# EAGLE design power mux-v7 (EAGLE 6.5.0)
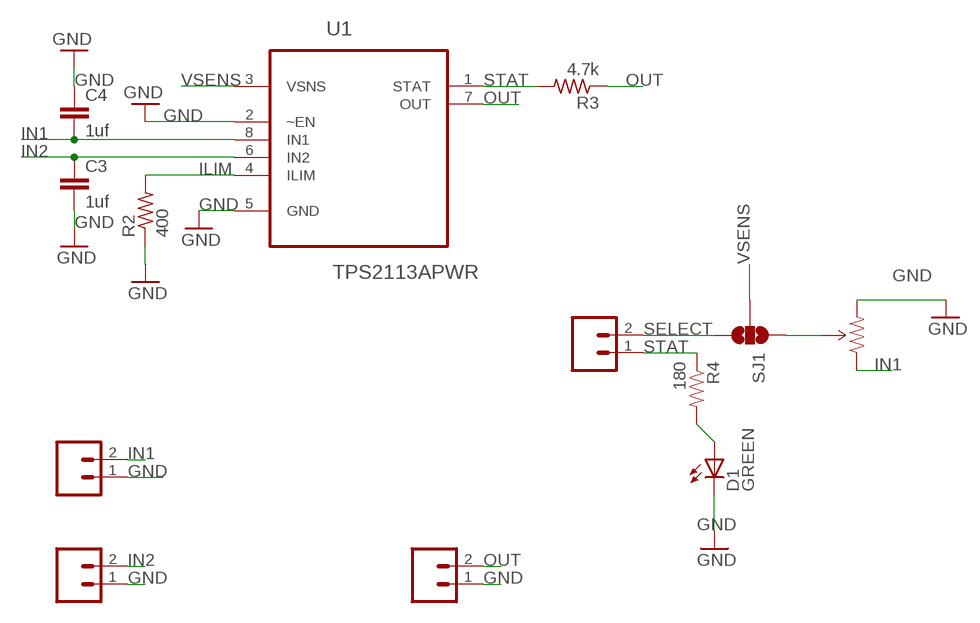
[diagram p0: schematic, sheet 1]

## Parts
C3  1uf  CAP0402-CAP  [0402-CAP]
C4  1uf  CAP0402-CAP  [0402-CAP]
D1  GREEN  LED-GREEN0603  [LED-0603]
JP3  M021X02_NO_SILK  [1X02_NO_SILK]
JP4  M021X02_NO_SILK  [1X02_NO_SILK]
JP5  M021X02_NO_SILK  [1X02_NO_SILK]
JP6  M021X02_NO_SILK  [1X02_NO_SILK]
R1  TRIMPOT-PTH-KNOB  [3386U]
R2  400  R-US_R0402  [R0402]
R3  4.7k  R-US_R0402  [R0402]
R4  180  RESISTOR0402-RES  [0402-RES]
SJ1  SOLDERJUMPER_2WAYPASTE1&2  [SJ_3_PASTE1&2]
U1  TPS2113APWR  [SOP65P640X120-8N]

## Nets
GND: C3.2 C4.1 D1.C JP3.1 JP4.1 JP6.1 R1.3(CW) R2.1 U1.2(~EN) U1.5(GND)
ILIM: R2.2 U1.4(ILIM)
IN1: C4.2 JP3.2 R1.1(CCW) U1.8(IN1)
IN2: C3.1 JP4.2 U1.6(IN2)
N$1: D1.A R4.2
N$2: R1.2(WIPER) SJ1.1
OUT: JP6.2 R3.1 U1.7(OUT)
SELECT: JP5.2 SJ1.3
STAT: JP5.1 R3.2 R4.1 U1.1(STAT)
VSENS: SJ1.2 U1.3(VSNS)

## Library data of the parts
C3 C4 = SparkFun-Capacitors:CAP: Capacitor Standard 0603 ceramic capacitor, and 0.1" leaded capacitor.
D1 = SparkFun-LED:LED-GREEN: Various green LEDs 0603- DIO-00821 LARGE- DIO-00862 LILYPAD- DIO-09910; PROD_ID: DIO-00821
JP3-JP6 = SparkFun-Connectors:M02: Standard 2-pin 0.1" header. Use with - straight break away headers ( PRT-00116) - right angle break away headers (PRT-00553) - swiss pins (PRT-00743) - machine pins (PRT-00117) - female headers (PRT-00115) Molex polarized connector foot print use with: PRT-08233 with associated crimp pins and housings. 2.54_SCREWTERM for use with PRT-10571. 3.5mm Screw Terminal footprints for PRT-08084 5mm Screw Terminal footprints for use with PRT-08433
R1 = SparkFun-Electromechanical:TRIMPOT: Various small potentiometers for "set-and-forget" applications
R2 R3 = resistor:R-US_: RESISTOR, American symbol
R4 = SparkFun-Passives:RESISTOR: Resistor Basic schematic elements and footprints for 0603, 1206, and PTH resistors.
SJ1 = SparkFun-Passives:SOLDERJUMPER_2WAY: Solder Jumper 2 way solder jumper
U1 = Texas Instruments_By_element14_Batch_1:TPS2113APWR: AUTOSWITCHING POWER MUX; MPN: TPS2113APWR; OC_FARNELL: 1757288; OC_NEWARK: 01J0961; PACKAGE: TSSOP-8; SUPPLIER: TEXAS INSTRUMENTS

## Board
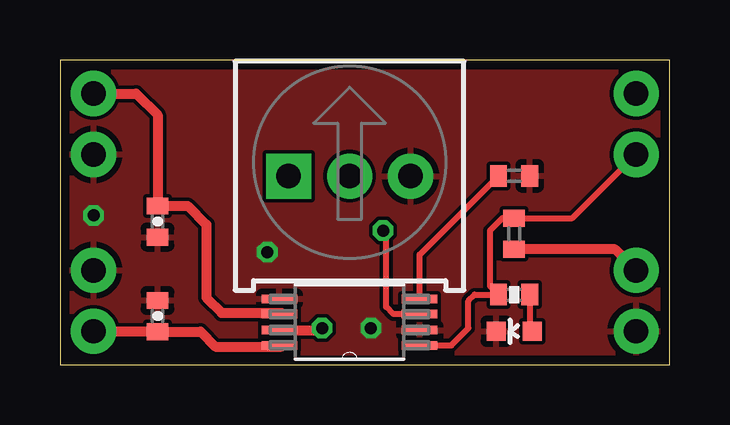
[diagram p1: board, top side]
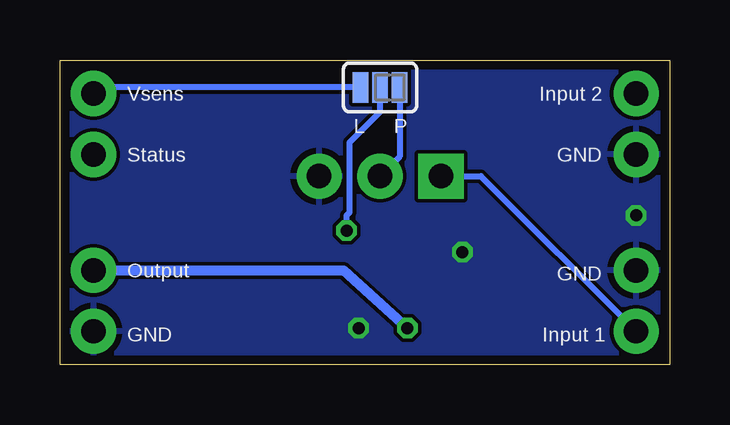
[diagram p2: board, bottom side, seen from below]

Size 25.4 x 12.7 mm. Coordinates in mm from the lower left corner, seen from the top.
Outline: 0,0 25.4,0 25.4,12.7 0,12.7 0,0
Copper layers (1*16): Top 0.0356mm / dielectric 1.5011mm / Bottom 0.0356mm
Design rules "LaenPCBOrder": minimum track width 6mil, minimum drill 13mil, track to track 6mil, track to pad 6mil, pad to pad 6mil, via to via 6mil, smd to smd 6mil, copper to edge 15mil, drill to drill 6mil, minimum pad ring 7mil, minimum via ring 7mil, stop-mask expansion 3mil, vias tented up to drill 0mil, thermal gap 10mil

### Footprints (pad centres in the part's own frame; a part is rotated, then mirrored left to right if it is on the bottom)
0402-CAP = smd 0.7 x 0.9: 1 -0.65,0; 2 0.65,0
LED-0603 = smd 0.8 x 0.8: A 0,-0.75; C 0,0.75
1X02_NO_SILK = drill 1.016 pad 1.88: 1 0,0; 2 2.54,0
3386U = drill 1.016 pad 1.88 square: 1 -2.54,-0.015 | drill 1.016 pad 1.88: 2 0,-0.015; 3 2.54,-0.015
R0402 = smd 0.7 x 0.9: 1 -0.65,0; 2 0.65,0
0402-RES = smd 0.7 x 0.9: 1 -0.65,0; 2 0.65,0
SJ_3_PASTE1&2 = smd 0.635 x 1.27: 1 -0.813,0; 2 0,0; 3 0.813,0
SOP65P640X120-8N = smd 1.473 x 0.356: 1 -2.921,0.965; 2 -2.921,0.33; 3 -2.921,-0.33; 4 -2.921,-0.965; 5 2.921,-0.965; 6 2.921,-0.33; 7 2.921,0.33; 8 2.921,0.965

### Placement (x,y rotation side)
C3  4.06,5.97 270 top
C4  4.06,2.03 270 top
D1  18.92,1.4 90 top
JP3  1.4,3.94 270 top
JP4  1.4,8.76 90 top
JP5  24,8.76 90 top
JP6  24,1.4 90 top
R1  12.06,7.87 0 top
R2  18.92,7.87 180 top
R3  18.92,5.46 90 top
R4  18.92,2.92 0 top
SJ1  12.06,11.56 180 bottom
U1  12.06,1.78 180 top

### Tracks (layer width: path | path; a pad name or v marks a point on that pad's centre or on a via)
GND  (via drill 0.5)
  other vias: 8.64,4.7 1.4,6.22 12.95,1.52
  pour Bottom: 0,12.7 25.4,12.7 25.4,0 0,0
  pour Top: 0,12.7 25.4,12.7 25.4,0 0,0
ILIM
  Top 0.254: U1.4 14.99,4.59 R2.2
IN1
  Top 0.406: JP3.2 4.05,1.4 C4.2 5.86,1.38 6.48,0.76 9.22,0.76 U1.8
  Bottom 0.254: R1.1 7.86,7.86 JP3.2
IN2
  Top 0.406: JP4.2 3.17,11.3 4.06,10.41 C3.1 5.32,6.62 6.1,5.84 6.1,2.79 6.73,2.16 9.22,2.16 U1.6
N$1
  Top 0.254: R4.2 19.57,1.5 D1.A
N$2
  Bottom 0.254: SJ1.1 11.25,8.67 R1.2
OUT  (via drill 0.5)
  Top 0.406: U1.7 10.85,1.45 v10.92,1.52 | JP6.2 23.13,4.81 R3.1
  Bottom 0.406: JP6.2 13.59,3.94 v10.92,1.52
SELECT
  Bottom 0.254: SJ1.3 23.75,11.56 JP5.2
STAT
  Top 0.254: JP5.1 21.35,6.11 R3.2 18.43,6.11 17.91,5.59 17.91,3.29 R4.1 17.27,2.92 17.02,2.67 17.02,1.52 16.31,0.81 U1.1
VSENS  (via drill 0.5)
  Top 0.254: U1.3 13.89,2.11 13.59,2.41 13.59,5.46 v13.46,5.59
  Bottom 0.254: v13.46,5.59 13.46,6.22 13.34,6.35 13.34,9.27 12.06,10.54 SJ1.2

### Text on the board
bPlace: Input 2 | Vsens | P | L | GND | Status | GND | Output | Input 1 | GND